# EAGLE board kocka1 (EAGLE 7.2.0), part 1 of 3
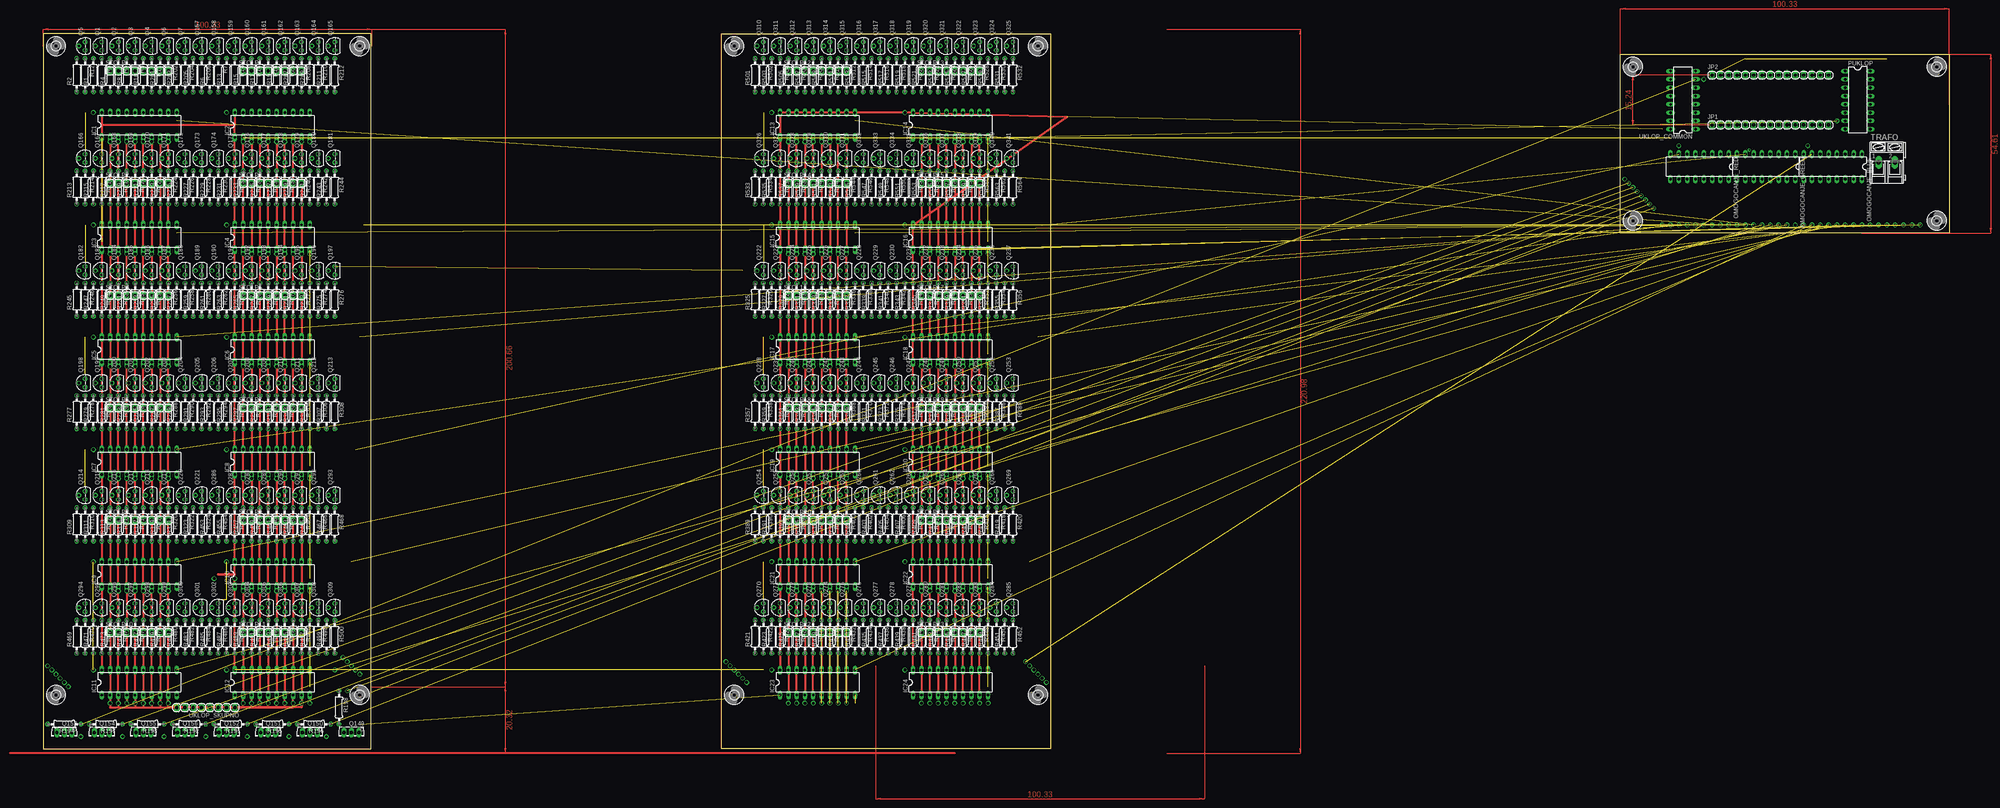
[diagram p5: board, top side]
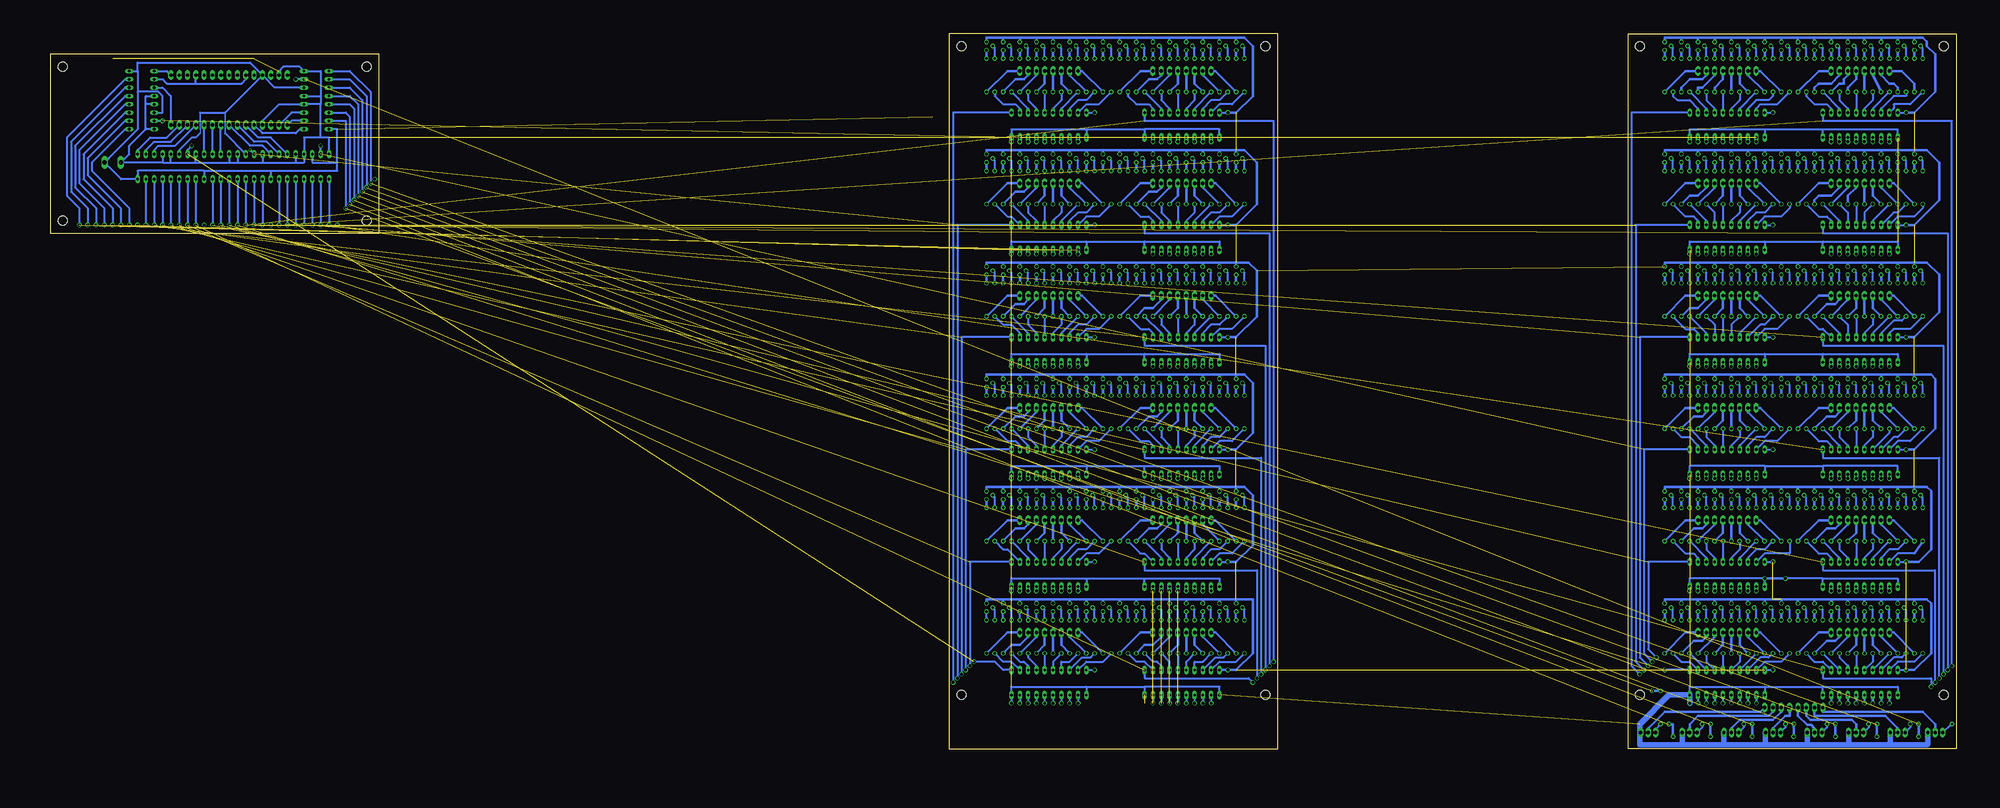
[diagram p6: board, bottom side, seen from below]

Size 581.66 x 218.44 mm. Coordinates in mm from the lower left corner, seen from the top.
Outline: 0,0 100,0 100,218.43 0,218.43 0,0
Outline: 207.01,218.44 307.34,218.44 307.34,0 207.01,0 207.01,218.44
Outline: 481.33,212.09 581.66,212.09 581.66,157.48 481.33,157.48 481.33,212.09
Copper layers (1*16): Top 0.035mm / dielectric 1.5mm / Bottom 0.035mm
Design rules "default *": minimum track width 10mil, minimum drill 24mil, track to track 40mil, track to pad 40mil, pad to pad 8mil, via to via 8mil, smd to smd 8mil, copper to edge 40mil, drill to drill 8mil, minimum pad ring 10mil, minimum via ring 8mil, stop-mask expansion 4mil, vias tented up to drill 0mil, thermal gap 10mil

## Footprints (pad centres in the part's own frame; a part is rotated, then mirrored left to right if it is on the bottom)
2,8 = hole 2.8: 0,0
DIL20 = drill 0.813 long: 1 -11.43,-3.81; 2 -8.89,-3.81; 3 -6.35,-3.81; 4 -3.81,-3.81; 5 -1.27,-3.81; 6 1.27,-3.81; 7 3.81,-3.81; 8 6.35,-3.81; 9 8.89,-3.81; 10 11.43,-3.81; 11 11.43,3.81; 12 8.89,3.81; 13 6.35,3.81; 14 3.81,3.81; 15 1.27,3.81; 16 -1.27,3.81; 17 -3.81,3.81; 18 -6.35,3.81; 19 -8.89,3.81; 20 -11.43,3.81
1X15 = drill 1.016 long: 1 -17.78,0; 2 -15.24,0; 3 -12.7,0; 4 -10.16,0; 5 -7.62,0; 6 -5.08,0; 7 -2.54,0; 8 0,0; 9 2.54,0; 10 5.08,0; 11 7.62,0; 12 10.16,0; 13 12.7,0; 14 15.24,0; 15 17.78,0
DIL16 = drill 0.813 long: 1 -8.89,-3.81; 2 -6.35,-3.81; 3 -3.81,-3.81; 4 -1.27,-3.81; 5 1.27,-3.81; 6 3.81,-3.81; 7 6.35,-3.81; 8 8.89,-3.81; 9 8.89,3.81; 10 6.35,3.81; 11 3.81,3.81; 12 1.27,3.81; 13 -1.27,3.81; 14 -3.81,3.81; 15 -6.35,3.81; 16 -8.89,3.81
TO92 = drill 0.813 octagon: 1 1.27,0; 2 0,1.905; 3 -1.27,0
TO126AV = drill 1.016 long: B 2.286,-1.27; C 0,-1.27; E -2.286,-1.27
0207/10 = drill 0.813 octagon: 1 -5.08,0; 2 5.08,0
1X08 = drill 1.016 long: 1 -8.89,0; 2 -6.35,0; 3 -3.81,0; 4 -1.27,0; 5 1.27,0; 6 3.81,0; 7 6.35,0; 8 8.89,0
AK300/2 = drill 1.321 long: 1 -2.515,0; 2 2.489,0

## Placement (x,y rotation side)
H5  MOUNT-HOLE2.8  [2,8]  485.14,208.28 0 top
H6  MOUNT-HOLE2.8  [2,8]  577.85,161.29 0 top
H7  MOUNT-HOLE2.8  [2,8]  485.14,161.29 0 top
H8  MOUNT-HOLE2.8  [2,8]  577.85,208.28 0 top
H9  MOUNT-HOLE2.8  [2,8]  303.53,16.51 0 top
H10  MOUNT-HOLE2.8  [2,8]  210.82,16.51 0 top
H11  MOUNT-HOLE2.8  [2,8]  303.53,214.63 0 top
H12  MOUNT-HOLE2.8  [2,8]  210.82,214.63 0 top
H13  MOUNT-HOLE2.8  [2,8]  96.52,214.63 0 top
H14  MOUNT-HOLE2.8  [2,8]  3.81,214.63 0 top
H15  MOUNT-HOLE2.8  [2,8]  3.81,16.51 0 top
H16  MOUNT-HOLE2.8  [2,8]  96.52,16.51 0 top
IC1  74HC574N  [DIL20]  29.21,190.5 0 top
IC2  74HC574N  [DIL20]  69.85,190.5 0 top
IC3  74HC574N  [DIL20]  29.21,156.21 0 top
IC4  74HC574N  [DIL20]  69.85,156.21 0 top
IC5  74HC574N  [DIL20]  29.21,121.92 0 top
IC6  74HC574N  [DIL20]  69.85,121.92 0 top
IC7  74HC574N  [DIL20]  29.21,87.63 0 top
IC8  74HC574N  [DIL20]  69.85,87.63 0 top
IC9  74HC574N  [DIL20]  29.21,53.34 0 top
IC10  74HC574N  [DIL20]  69.85,53.34 0 top
IC11  74HC574N  [DIL20]  29.21,20.32 0 top
IC12  74HC574N  [DIL20]  69.85,20.32 0 top
IC13  74HC574N  [DIL20]  236.22,190.5 0 top
IC14  74HC574N  [DIL20]  276.86,190.5 0 top
IC15  74HC574N  [DIL20]  236.22,156.21 0 top
IC16  74HC574N  [DIL20]  276.86,156.21 0 top
IC17  74HC574N  [DIL20]  236.22,121.92 0 top
IC18  74HC574N  [DIL20]  276.86,121.92 0 top
IC19  74HC574N  [DIL20]  236.22,87.63 0 top
IC20  74HC574N  [DIL20]  276.86,87.63 0 top
IC21  74HC574N  [DIL20]  236.22,53.34 0 top
IC22  74HC574N  [DIL20]  276.86,53.34 0 top
IC23  74HC574N  [DIL20]  236.22,20.32 0 top
IC24  74HC574N  [DIL20]  276.86,20.32 0 top
JP1  [1X15]  527.05,190.5 0 top
JP2  [1X15]  527.05,205.74 0 top
OMOGOCANJE_BLUE  74HC138N  [DIL16]  546.1,177.8 180 top
OMOGOCANJE_GREEN  74HC138N  [DIL16]  525.78,177.8 180 top
OMOGOCANJE_RED  74HC138N  [DIL16]  505.46,177.8 180 top
PUKLOP  74HC138N  [DIL16]  553.72,198.12 270 top
Q1  2N3904  [TO92]  17.78,214.63 90 top
Q2  2N3904  [TO92]  22.86,214.63 90 top
Q3  2N3904  [TO92]  27.94,214.63 90 top
Q4  2N3904  [TO92]  33.02,214.63 90 top
Q5  2N3904  [TO92]  12.7,214.63 90 top
Q6  2N3904  [TO92]  38.1,214.63 90 top
Q7  2N3904  [TO92]  43.18,214.63 90 top
Q149  BD139  [TO126AV]  93.98,3.81 180 top
Q150  BD139  [TO126AV]  81.28,3.81 180 top
Q151  BD139  [TO126AV]  68.58,3.81 180 top
Q152  BD139  [TO126AV]  55.88,3.81 180 top
Q153  BD139  [TO126AV]  6.35,3.81 180 top
Q154  BD139  [TO126AV]  17.78,3.81 180 top
Q155  BD139  [TO126AV]  30.48,3.81 180 top
Q156  BD139  [TO126AV]  43.18,3.81 180 top
Q157  2N3904  [TO92]  48.26,214.63 90 top
Q158  2N3904  [TO92]  53.34,214.63 90 top
Q159  2N3904  [TO92]  58.42,214.63 90 top
Q160  2N3904  [TO92]  63.5,214.63 90 top
Q161  2N3904  [TO92]  68.58,214.63 90 top
Q162  2N3904  [TO92]  73.66,214.63 90 top
Q163  2N3904  [TO92]  78.74,214.63 90 top
Q164  2N3904  [TO92]  83.82,214.63 90 top
Q165  2N3904  [TO92]  88.9,214.63 90 top
Q166  2N3904  [TO92]  12.7,180.34 90 top
Q167  2N3904  [TO92]  17.78,180.34 90 top
Q168  2N3904  [TO92]  22.86,180.34 90 top
Q169  2N3904  [TO92]  27.94,180.34 90 top
Q170  2N3904  [TO92]  33.02,180.34 90 top
Q171  2N3904  [TO92]  38.1,180.34 90 top
Q172  2N3904  [TO92]  43.18,180.34 90 top
Q173  2N3904  [TO92]  48.26,180.34 90 top
Q174  2N3904  [TO92]  53.34,180.34 90 top
Q175  2N3904  [TO92]  58.42,180.34 90 top
Q176  2N3904  [TO92]  63.5,180.34 90 top
Q177  2N3904  [TO92]  68.58,180.34 90 top
Q178  2N3904  [TO92]  73.66,180.34 90 top
Q179  2N3904  [TO92]  78.74,180.34 90 top
Q180  2N3904  [TO92]  83.82,180.34 90 top
Q181  2N3904  [TO92]  88.9,180.34 90 top
Q182  2N3904  [TO92]  12.7,146.05 90 top
Q183  2N3904  [TO92]  17.78,146.05 90 top
Q184  2N3904  [TO92]  22.86,146.05 90 top
Q185  2N3904  [TO92]  27.94,146.05 90 top
Q186  2N3904  [TO92]  33.02,146.05 90 top
Q187  2N3904  [TO92]  38.1,146.05 90 top
Q188  2N3904  [TO92]  43.18,146.05 90 top
Q189  2N3904  [TO92]  48.26,146.05 90 top
Q190  2N3904  [TO92]  53.34,146.05 90 top
Q191  2N3904  [TO92]  58.42,146.05 90 top
Q192  2N3904  [TO92]  63.5,146.05 90 top
Q193  2N3904  [TO92]  68.58,146.05 90 top
Q194  2N3904  [TO92]  73.66,146.05 90 top
Q195  2N3904  [TO92]  78.74,146.05 90 top
Q196  2N3904  [TO92]  83.82,146.05 90 top
Q197  2N3904  [TO92]  88.9,146.05 90 top
Q198  2N3904  [TO92]  12.7,111.76 90 top
Q199  2N3904  [TO92]  17.78,111.76 90 top
Q200  2N3904  [TO92]  22.86,111.76 90 top
Q201  2N3904  [TO92]  27.94,111.76 90 top
Q202  2N3904  [TO92]  33.02,111.76 90 top
Q203  2N3904  [TO92]  38.1,111.76 90 top
Q204  2N3904  [TO92]  43.18,111.76 90 top
Q205  2N3904  [TO92]  48.26,111.76 90 top
Q206  2N3904  [TO92]  53.34,111.76 90 top
Q207  2N3904  [TO92]  58.42,111.76 90 top
Q208  2N3904  [TO92]  63.5,111.76 90 top
Q209  2N3904  [TO92]  68.58,111.76 90 top
Q210  2N3904  [TO92]  73.66,111.76 90 top
Q211  2N3904  [TO92]  78.74,111.76 90 top
Q212  2N3904  [TO92]  83.82,111.76 90 top
Q213  2N3904  [TO92]  88.9,111.76 90 top
Q214  2N3904  [TO92]  12.7,77.47 90 top
Q215  2N3904  [TO92]  17.78,77.47 90 top
Q216  2N3904  [TO92]  22.86,77.47 90 top
Q217  2N3904  [TO92]  27.94,77.47 90 top
Q218  2N3904  [TO92]  33.02,77.47 90 top
Q219  2N3904  [TO92]  38.1,77.47 90 top
Q220  2N3904  [TO92]  43.18,77.47 90 top
Q221  2N3904  [TO92]  48.26,77.47 90 top
Q222  2N3904  [TO92]  219.71,146.05 90 top
Q223  2N3904  [TO92]  224.79,146.05 90 top
Q224  2N3904  [TO92]  229.87,146.05 90 top
Q225  2N3904  [TO92]  234.95,146.05 90 top
Q226  2N3904  [TO92]  240.03,146.05 90 top
Q227  2N3904  [TO92]  245.11,146.05 90 top
Q228  2N3904  [TO92]  250.19,146.05 90 top
Q229  2N3904  [TO92]  255.27,146.05 90 top
Q230  2N3904  [TO92]  260.35,146.05 90 top
Q231  2N3904  [TO92]  265.43,146.05 90 top
Q232  2N3904  [TO92]  270.51,146.05 90 top
Q233  2N3904  [TO92]  275.59,146.05 90 top
Q234  2N3904  [TO92]  280.67,146.05 90 top
Q235  2N3904  [TO92]  285.75,146.05 90 top
Q236  2N3904  [TO92]  290.83,146.05 90 top
Q237  2N3904  [TO92]  295.91,146.05 90 top
Q238  2N3904  [TO92]  219.71,111.76 90 top
Q239  2N3904  [TO92]  224.79,111.76 90 top
Q240  2N3904  [TO92]  229.87,111.76 90 top
Q241  2N3904  [TO92]  234.95,111.76 90 top
Q242  2N3904  [TO92]  240.03,111.76 90 top
Q243  2N3904  [TO92]  245.11,111.76 90 top
Q244  2N3904  [TO92]  250.19,111.76 90 top
Q245  2N3904  [TO92]  255.27,111.76 90 top
Q246  2N3904  [TO92]  260.35,111.76 90 top
Q247  2N3904  [TO92]  265.43,111.76 90 top
Q248  2N3904  [TO92]  270.51,111.76 90 top
Q249  2N3904  [TO92]  275.59,111.76 90 top
Q250  2N3904  [TO92]  280.67,111.76 90 top
Q251  2N3904  [TO92]  285.75,111.76 90 top
Q252  2N3904  [TO92]  290.83,111.76 90 top
Q253  2N3904  [TO92]  295.91,111.76 90 top
Q254  2N3904  [TO92]  219.71,77.47 90 top
Q255  2N3904  [TO92]  224.79,77.47 90 top
Q256  2N3904  [TO92]  229.87,77.47 90 top
Q257  2N3904  [TO92]  234.95,77.47 90 top
Q258  2N3904  [TO92]  240.03,77.47 90 top
Q259  2N3904  [TO92]  245.11,77.47 90 top
Q260  2N3904  [TO92]  250.19,77.47 90 top
Q261  2N3904  [TO92]  255.27,77.47 90 top
Q262  2N3904  [TO92]  260.35,77.47 90 top
Q263  2N3904  [TO92]  265.43,77.47 90 top
Q264  2N3904  [TO92]  270.51,77.47 90 top
Q265  2N3904  [TO92]  275.59,77.47 90 top
Q266  2N3904  [TO92]  280.67,77.47 90 top
Q267  2N3904  [TO92]  285.75,77.47 90 top
Q268  2N3904  [TO92]  290.83,77.47 90 top
Q269  2N3904  [TO92]  295.91,77.47 90 top
Q270  2N3904  [TO92]  219.71,43.18 90 top
Q271  2N3904  [TO92]  224.79,43.18 90 top
Q272  2N3904  [TO92]  229.87,43.18 90 top
Q273  2N3904  [TO92]  234.95,43.18 90 top
Q274  2N3904  [TO92]  240.03,43.18 90 top
Q275  2N3904  [TO92]  245.11,43.18 90 top
Q276  2N3904  [TO92]  250.19,43.18 90 top
Q277  2N3904  [TO92]  255.27,43.18 90 top
Q278  2N3904  [TO92]  260.35,43.18 90 top
Q279  2N3904  [TO92]  265.43,43.18 90 top
Q280  2N3904  [TO92]  270.51,43.18 90 top
Q281  2N3904  [TO92]  275.59,43.18 90 top
Q282  2N3904  [TO92]  280.67,43.18 90 top
Q283  2N3904  [TO92]  285.75,43.18 90 top
Q284  2N3904  [TO92]  290.83,43.18 90 top
Q285  2N3904  [TO92]  295.91,43.18 90 top
Q286  2N3904  [TO92]  53.34,77.47 90 top
Q287  2N3904  [TO92]  58.42,77.47 90 top
Q288  2N3904  [TO92]  63.5,77.47 90 top
Q289  2N3904  [TO92]  68.58,77.47 90 top
Q290  2N3904  [TO92]  73.66,77.47 90 top
Q291  2N3904  [TO92]  78.74,77.47 90 top
Q292  2N3904  [TO92]  83.82,77.47 90 top
Q293  2N3904  [TO92]  88.9,77.47 90 top
Q294  2N3904  [TO92]  12.7,43.18 90 top
Q295  2N3904  [TO92]  17.78,43.18 90 top
Q296  2N3904  [TO92]  22.86,43.18 90 top
Q297  2N3904  [TO92]  27.94,43.18 90 top
Q298  2N3904  [TO92]  33.02,43.18 90 top
Q299  2N3904  [TO92]  38.1,43.18 90 top
Q300  2N3904  [TO92]  43.18,43.18 90 top
Q301  2N3904  [TO92]  48.26,43.18 90 top
Q302  2N3904  [TO92]  53.34,43.18 90 top
Q303  2N3904  [TO92]  58.42,43.18 90 top
Q304  2N3904  [TO92]  63.5,43.18 90 top
Q305  2N3904  [TO92]  68.58,43.18 90 top
Q306  2N3904  [TO92]  73.66,43.18 90 top
Q307  2N3904  [TO92]  78.74,43.18 90 top
Q308  2N3904  [TO92]  83.82,43.18 90 top
Q309  2N3904  [TO92]  88.9,43.18 90 top
Q310  2N3904  [TO92]  219.71,214.63 90 top
Q311  2N3904  [TO92]  224.79,214.63 90 top
Q312  2N3904  [TO92]  229.87,214.63 90 top
Q313  2N3904  [TO92]  234.95,214.63 90 top
Q314  2N3904  [TO92]  240.03,214.63 90 top
Q315  2N3904  [TO92]  245.11,214.63 90 top
Q316  2N3904  [TO92]  250.19,214.63 90 top
Q317  2N3904  [TO92]  255.27,214.63 90 top
Q318  2N3904  [TO92]  260.35,214.63 90 top
Q319  2N3904  [TO92]  265.43,214.63 90 top
Q320  2N3904  [TO92]  270.51,214.63 90 top
Q321  2N3904  [TO92]  275.59,214.63 90 top
Q322  2N3904  [TO92]  280.67,214.63 90 top
Q323  2N3904  [TO92]  285.75,214.63 90 top
Q324  2N3904  [TO92]  290.83,214.63 90 top
Q325  2N3904  [TO92]  295.91,214.63 90 top
Q326  2N3904  [TO92]  219.71,180.34 90 top
Q327  2N3904  [TO92]  224.79,180.34 90 top
Q328  2N3904  [TO92]  229.87,180.34 90 top
Q329  2N3904  [TO92]  234.95,180.34 90 top
Q330  2N3904  [TO92]  240.03,180.34 90 top
Q331  2N3904  [TO92]  245.11,180.34 90 top
Q332  2N3904  [TO92]  250.19,180.34 90 top
Q333  2N3904  [TO92]  255.27,180.34 90 top
Q334  2N3904  [TO92]  260.35,180.34 90 top
Q335  2N3904  [TO92]  265.43,180.34 90 top
Q336  2N3904  [TO92]  270.51,180.34 90 top
Q337  2N3904  [TO92]  275.59,180.34 90 top
Q338  2N3904  [TO92]  280.67,180.34 90 top
Q339  2N3904  [TO92]  285.75,180.34 90 top
Q340  2N3904  [TO92]  290.83,180.34 90 top
Q341  2N3904  [TO92]  295.91,180.34 90 top
R1  1k  [0207/10]  15.24,205.74 90 top
R2  1k  [0207/10]  10.16,205.74 90 top
R3  240  [0207/10]  17.78,205.74 270 top
R4  1k  [0207/10]  20.32,205.74 90 top
R5  240  [0207/10]  22.86,205.74 270 top
R6  1k  [0207/10]  50.8,205.74 90 top
R7  240  [0207/10]  53.34,205.74 270 top
R8  1k  [0207/10]  25.4,205.74 90 top
R9  240  [0207/10]  27.94,205.74 270 top
R10  1k  [0207/10]  30.48,205.74 90 top
R11  240  [0207/10]  33.02,205.74 270 top
R12  240  [0207/10]  12.7,205.74 270 top
R13  1k  [0207/10]  55.88,205.74 90 top
R14  240  [0207/10]  58.42,205.74 270 top
R15  1k  [0207/10]  60.96,205.74 90 top
R16  240  [0207/10]  63.5,205.74 270 top
R17  1k  [0207/10]  66.04,205.74 90 top
R18  240  [0207/10]  68.58,205.74 270 top
R19  1k  [0207/10]  71.12,205.74 90 top
R20  240  [0207/10]  73.66,205.74 270 top
R191  240  [0207/10]  57.15,7.62 180 top
R192  240  [0207/10]  44.45,7.62 180 top
R193  240  [0207/10]  31.75,7.62 180 top
R194  240  [0207/10]  6.35,7.62 180 top
R195  240  [0207/10]  69.85,7.62 180 top
R196  240  [0207/10]  82.55,7.62 180 top
R197  240  [0207/10]  19.05,7.62 180 top
R198  240  [0207/10]  90.17,12.7 270 top
R201  1k  [0207/10]  35.56,205.74 90 top
R202  240  [0207/10]  38.1,205.74 270 top
R203  1k  [0207/10]  40.64,205.74 90 top
R204  240  [0207/10]  43.18,205.74 270 top
R205  1k  [0207/10]  45.72,205.74 90 top
R206  240  [0207/10]  48.26,205.74 270 top
R207  1k  [0207/10]  76.2,205.74 90 top
R208  240  [0207/10]  78.74,205.74 270 top
R209  1k  [0207/10]  81.28,205.74 90 top
R210  240  [0207/10]  83.82,205.74 270 top
R211  1k  [0207/10]  86.36,205.74 90 top
R212  240  [0207/10]  88.9,205.74 270 top
R213  1k  [0207/10]  10.16,171.45 90 top
R214  240  [0207/10]  12.7,171.45 270 top
R215  1k  [0207/10]  15.24,171.45 90 top
R216  240  [0207/10]  17.78,171.45 270 top
R217  1k  [0207/10]  20.32,171.45 90 top
R218  240  [0207/10]  22.86,171.45 270 top
R219  1k  [0207/10]  25.4,171.45 90 top
R220  240  [0207/10]  27.94,171.45 270 top
R221  1k  [0207/10]  30.48,171.45 90 top
R222  240  [0207/10]  33.02,171.45 270 top
R223  1k  [0207/10]  35.56,171.45 90 top
R224  240  [0207/10]  38.1,171.45 270 top
R225  1k  [0207/10]  40.64,171.45 90 top
R226  240  [0207/10]  43.18,171.45 270 top
R227  1k  [0207/10]  45.72,171.45 90 top
R228  240  [0207/10]  48.26,171.45 270 top
R229  1k  [0207/10]  50.8,171.45 90 top
R230  240  [0207/10]  53.34,171.45 270 top
R231  1k  [0207/10]  55.88,171.45 90 top
R232  240  [0207/10]  58.42,171.45 270 top
R233  1k  [0207/10]  60.96,171.45 90 top
R234  240  [0207/10]  63.5,171.45 270 top
R235  1k  [0207/10]  66.04,171.45 90 top
R236  240  [0207/10]  68.58,171.45 270 top
R237  1k  [0207/10]  71.12,171.45 90 top
R238  240  [0207/10]  73.66,171.45 270 top
R239  1k  [0207/10]  76.2,171.45 90 top
R240  240  [0207/10]  78.74,171.45 270 top
R241  1k  [0207/10]  81.28,171.45 90 top
R242  240  [0207/10]  83.82,171.45 270 top
R243  1k  [0207/10]  86.36,171.45 90 top
R244  240  [0207/10]  88.9,171.45 270 top
R245  1k  [0207/10]  10.16,137.16 90 top
R246  240  [0207/10]  12.7,137.16 270 top
R247  1k  [0207/10]  15.24,137.16 90 top
R248  240  [0207/10]  17.78,137.16 270 top
R249  1k  [0207/10]  20.32,137.16 90 top
R250  240  [0207/10]  22.86,137.16 270 top
R251  1k  [0207/10]  25.4,137.16 90 top
R252  240  [0207/10]  27.94,137.16 270 top
R253  1k  [0207/10]  30.48,137.16 90 top
R254  240  [0207/10]  33.02,137.16 270 top
R255  1k  [0207/10]  35.56,137.16 90 top
R256  240  [0207/10]  38.1,137.16 270 top
R257  1k  [0207/10]  40.64,137.16 90 top
R258  240  [0207/10]  43.18,137.16 270 top
R259  1k  [0207/10]  45.72,137.16 90 top
R260  240  [0207/10]  48.26,137.16 270 top
R261  1k  [0207/10]  50.8,137.16 90 top
R262  240  [0207/10]  53.34,137.16 270 top
R263  1k  [0207/10]  55.88,137.16 90 top
R264  240  [0207/10]  58.42,137.16 270 top
R265  1k  [0207/10]  60.96,137.16 90 top
R266  240  [0207/10]  63.5,137.16 270 top
R267  1k  [0207/10]  66.04,137.16 90 top
R268  240  [0207/10]  68.58,137.16 270 top
R269  1k  [0207/10]  71.12,137.16 90 top
R270  240  [0207/10]  73.66,137.16 270 top
R271  1k  [0207/10]  76.2,137.16 90 top
R272  240  [0207/10]  78.74,137.16 270 top
R273  1k  [0207/10]  81.28,137.16 90 top
R274  240  [0207/10]  83.82,137.16 270 top
R275  1k  [0207/10]  86.36,137.16 90 top
R276  240  [0207/10]  88.9,137.16 270 top
R277  1k  [0207/10]  10.16,102.87 90 top
R278  240  [0207/10]  12.7,102.87 270 top
R279  1k  [0207/10]  15.24,102.87 90 top
R280  240  [0207/10]  17.78,102.87 270 top
R281  1k  [0207/10]  20.32,102.87 90 top
R282  240  [0207/10]  22.86,102.87 270 top
R283  1k  [0207/10]  25.4,102.87 90 top
R284  240  [0207/10]  27.94,102.87 270 top
R285  1k  [0207/10]  30.48,102.87 90 top
R286  240  [0207/10]  33.02,102.87 270 top
R287  1k  [0207/10]  35.56,102.87 90 top
R288  240  [0207/10]  38.1,102.87 270 top
R289  1k  [0207/10]  40.64,102.87 90 top
R290  240  [0207/10]  43.18,102.87 270 top
R291  1k  [0207/10]  45.72,102.87 90 top
R292  240  [0207/10]  48.26,102.87 270 top
R293  1k  [0207/10]  50.8,102.87 90 top
R294  240  [0207/10]  53.34,102.87 270 top
R295  1k  [0207/10]  55.88,102.87 90 top
R296  240  [0207/10]  58.42,102.87 270 top
R297  1k  [0207/10]  60.96,102.87 90 top
R298  240  [0207/10]  63.5,102.87 270 top
R299  1k  [0207/10]  66.04,102.87 90 top
R300  240  [0207/10]  68.58,102.87 270 top
R301  1k  [0207/10]  71.12,102.87 90 top
R302  240  [0207/10]  73.66,102.87 270 top
R303  1k  [0207/10]  76.2,102.87 90 top
R304  240  [0207/10]  78.74,102.87 270 top
R305  1k  [0207/10]  81.28,102.87 90 top
R306  240  [0207/10]  83.82,102.87 270 top
R307  1k  [0207/10]  86.36,102.87 90 top
R308  240  [0207/10]  88.9,102.87 270 top
R309  1k  [0207/10]  10.16,68.58 90 top
R310  240  [0207/10]  12.7,68.58 270 top
R311  1k  [0207/10]  15.24,68.58 90 top
R312  240  [0207/10]  17.78,68.58 270 top
R313  1k  [0207/10]  20.32,68.58 90 top
R314  240  [0207/10]  22.86,68.58 270 top
R315  1k  [0207/10]  25.4,68.58 90 top
R316  240  [0207/10]  27.94,68.58 270 top
R317  1k  [0207/10]  30.48,68.58 90 top
R318  240  [0207/10]  33.02,68.58 270 top
R319  1k  [0207/10]  35.56,68.58 90 top
R320  240  [0207/10]  38.1,68.58 270 top
R321  1k  [0207/10]  40.64,68.58 90 top
R322  240  [0207/10]  43.18,68.58 270 top
R323  1k  [0207/10]  45.72,68.58 90 top
R324  240  [0207/10]  48.26,68.58 270 top
R325  1k  [0207/10]  217.17,137.16 90 top
R326  240  [0207/10]  219.71,137.16 270 top
R327  1k  [0207/10]  222.25,137.16 90 top
R328  240  [0207/10]  224.79,137.16 270 top
R329  1k  [0207/10]  227.33,137.16 90 top
R330  240  [0207/10]  229.87,137.16 270 top
R331  1k  [0207/10]  232.41,137.16 90 top
R332  240  [0207/10]  234.95,137.16 270 top
R333  1k  [0207/10]  237.49,137.16 90 top
R334  240  [0207/10]  240.03,137.16 270 top
R335  1k  [0207/10]  242.57,137.16 90 top
R336  240  [0207/10]  245.11,137.16 270 top
R337  1k  [0207/10]  247.65,137.16 90 top
R338  240  [0207/10]  250.19,137.16 270 top
R339  1k  [0207/10]  252.73,137.16 90 top
R340  240  [0207/10]  255.27,137.16 270 top
R341  1k  [0207/10]  257.81,137.16 90 top
R342  240  [0207/10]  260.35,137.16 270 top
R343  1k  [0207/10]  262.89,137.16 90 top
R344  240  [0207/10]  265.43,137.16 270 top
R345  1k  [0207/10]  267.97,137.16 90 top
R346  240  [0207/10]  270.51,137.16 270 top
R347  1k  [0207/10]  273.05,137.16 90 top
R348  240  [0207/10]  275.59,137.16 270 top
R349  1k  [0207/10]  278.13,137.16 90 top
R350  240  [0207/10]  280.67,137.16 270 top
R351  1k  [0207/10]  283.21,137.16 90 top
R352  240  [0207/10]  285.75,137.16 270 top
R353  1k  [0207/10]  288.29,137.16 90 top
R354  240  [0207/10]  290.83,137.16 270 top
R355  1k  [0207/10]  293.37,137.16 90 top
R356  240  [0207/10]  295.91,137.16 270 top
R357  1k  [0207/10]  217.17,102.87 90 top
R358  240  [0207/10]  219.71,102.87 270 top
R359  1k  [0207/10]  222.25,102.87 90 top
R360  240  [0207/10]  224.79,102.87 270 top
R361  1k  [0207/10]  227.33,102.87 90 top
R362  240  [0207/10]  229.87,102.87 270 top
R363  1k  [0207/10]  232.41,102.87 90 top
R364  240  [0207/10]  234.95,102.87 270 top
R365  1k  [0207/10]  237.49,102.87 90 top
R366  240  [0207/10]  240.03,102.87 270 top
R367  1k  [0207/10]  242.57,102.87 90 top
R368  240  [0207/10]  245.11,102.87 270 top
R369  1k  [0207/10]  247.65,102.87 90 top
R370  240  [0207/10]  250.19,102.87 270 top
R371  1k  [0207/10]  252.73,102.87 90 top
R372  240  [0207/10]  255.27,102.87 270 top
R373  1k  [0207/10]  257.81,102.87 90 top
R374  240  [0207/10]  260.35,102.87 270 top
R375  1k  [0207/10]  262.89,102.87 90 top
R376  240  [0207/10]  265.43,102.87 270 top
R377  1k  [0207/10]  267.97,102.87 90 top
R378  240  [0207/10]  270.51,102.87 270 top
R379  1k  [0207/10]  273.05,102.87 90 top
R380  240  [0207/10]  275.59,102.87 270 top
R381  1k  [0207/10]  278.13,102.87 90 top
R382  240  [0207/10]  280.67,102.87 270 top
R383  1k  [0207/10]  283.21,102.87 90 top
R384  240  [0207/10]  285.75,102.87 270 top
R385  1k  [0207/10]  288.29,102.87 90 top
R386  240  [0207/10]  290.83,102.87 270 top
R387  1k  [0207/10]  293.37,102.87 90 top
R388  240  [0207/10]  295.91,102.87 270 top
R389  1k  [0207/10]  217.17,68.58 90 top
R390  240  [0207/10]  219.71,68.58 270 top
R391  1k  [0207/10]  222.25,68.58 90 top
R392  240  [0207/10]  224.79,68.58 270 top
R393  1k  [0207/10]  227.33,68.58 90 top
R394  240  [0207/10]  229.87,68.58 270 top
R395  1k  [0207/10]  232.41,68.58 90 top
R396  240  [0207/10]  234.95,68.58 270 top
R397  1k  [0207/10]  237.49,68.58 90 top
R398  240  [0207/10]  240.03,68.58 270 top
R399  1k  [0207/10]  242.57,68.58 90 top
R400  240  [0207/10]  245.11,68.58 270 top
R401  1k  [0207/10]  247.65,68.58 90 top
R402  240  [0207/10]  250.19,68.58 270 top
R403  1k  [0207/10]  252.73,68.58 90 top
R404  240  [0207/10]  255.27,68.58 270 top
R405  1k  [0207/10]  257.81,68.58 90 top
R406  240  [0207/10]  260.35,68.58 270 top
R407  1k  [0207/10]  262.89,68.58 90 top
R408  240  [0207/10]  265.43,68.58 270 top
R409  1k  [0207/10]  267.97,68.58 90 top
R410  240  [0207/10]  270.51,68.58 270 top
R411  1k  [0207/10]  273.05,68.58 90 top
R412  240  [0207/10]  275.59,68.58 270 top
R413  1k  [0207/10]  278.13,68.58 90 top
R414  240  [0207/10]  280.67,68.58 270 top
R415  1k  [0207/10]  283.21,68.58 90 top
R416  240  [0207/10]  285.75,68.58 270 top
R417  1k  [0207/10]  288.29,68.58 90 top
R418  240  [0207/10]  290.83,68.58 270 top
R419  1k  [0207/10]  293.37,68.58 90 top
R420  240  [0207/10]  295.91,68.58 270 top
R421  1k  [0207/10]  217.17,34.29 90 top
R422  240  [0207/10]  219.71,34.29 270 top
R423  1k  [0207/10]  222.25,34.29 90 top
R424  240  [0207/10]  224.79,34.29 270 top
R425  1k  [0207/10]  227.33,34.29 90 top
R426  240  [0207/10]  229.87,34.29 270 top
R427  1k  [0207/10]  232.41,34.29 90 top
R428  240  [0207/10]  234.95,34.29 270 top
R429  1k  [0207/10]  237.49,34.29 90 top
R430  240  [0207/10]  240.03,34.29 270 top
R431  1k  [0207/10]  242.57,34.29 90 top
R432  240  [0207/10]  245.11,34.29 270 top
R433  1k  [0207/10]  247.65,34.29 90 top
R434  240  [0207/10]  250.19,34.29 270 top
R435  1k  [0207/10]  252.73,34.29 90 top
R436  240  [0207/10]  255.27,34.29 270 top
R437  1k  [0207/10]  257.81,34.29 90 top
R438  240  [0207/10]  260.35,34.29 270 top
R439  1k  [0207/10]  262.89,34.29 90 top
R440  240  [0207/10]  265.43,34.29 270 top
R441  1k  [0207/10]  267.97,34.29 90 top
R442  240  [0207/10]  270.51,34.29 270 top
R443  1k  [0207/10]  273.05,34.29 90 top
R444  240  [0207/10]  275.59,34.29 270 top
R445  1k  [0207/10]  278.13,34.29 90 top
R446  240  [0207/10]  280.67,34.29 270 top
R447  1k  [0207/10]  283.21,34.29 90 top
R448  240  [0207/10]  285.75,34.29 270 top
R449  1k  [0207/10]  288.29,34.29 90 top
R450  240  [0207/10]  290.83,34.29 270 top
R451  1k  [0207/10]  293.37,34.29 90 top
R452  240  [0207/10]  295.91,34.29 270 top
R453  1k  [0207/10]  50.8,68.58 90 top
R454  240  [0207/10]  53.34,68.58 270 top
R455  1k  [0207/10]  55.88,68.58 90 top
R456  240  [0207/10]  58.42,68.58 270 top
R457  1k  [0207/10]  60.96,68.58 90 top
R458  240  [0207/10]  63.5,68.58 270 top
R459  1k  [0207/10]  66.04,68.58 90 top
R460  240  [0207/10]  68.58,68.58 270 top
R461  1k  [0207/10]  71.12,68.58 90 top
R462  240  [0207/10]  73.66,68.58 270 top
R463  1k  [0207/10]  76.2,68.58 90 top
R464  240  [0207/10]  78.74,68.58 270 top
R465  1k  [0207/10]  81.28,68.58 90 top
R466  240  [0207/10]  83.82,68.58 270 top
R467  1k  [0207/10]  86.36,68.58 90 top
R468  240  [0207/10]  88.9,68.58 270 top
R469  1k  [0207/10]  10.16,34.29 90 top
R470  240  [0207/10]  12.7,34.29 270 top
R471  1k  [0207/10]  15.24,34.29 90 top
R472  240  [0207/10]  17.78,34.29 270 top
R473  1k  [0207/10]  20.32,34.29 90 top
R474  240  [0207/10]  22.86,34.29 270 top
R475  1k  [0207/10]  25.4,34.29 90 top
R476  240  [0207/10]  27.94,34.29 270 top
R477  1k  [0207/10]  30.48,34.29 90 top
R478  240  [0207/10]  33.02,34.29 270 top
R479  1k  [0207/10]  35.56,34.29 90 top
R480  240  [0207/10]  38.1,34.29 270 top
R481  1k  [0207/10]  40.64,34.29 90 top
R482  240  [0207/10]  43.18,34.29 270 top
R483  1k  [0207/10]  45.72,34.29 90 top
R484  240  [0207/10]  48.26,34.29 270 top
R485  1k  [0207/10]  50.8,34.29 90 top
R486  240  [0207/10]  53.34,34.29 270 top
R487  1k  [0207/10]  55.88,34.29 90 top
R488  240  [0207/10]  58.42,34.29 270 top
R489  1k  [0207/10]  60.96,34.29 90 top
R490  240  [0207/10]  63.5,34.29 270 top
R491  1k  [0207/10]  66.04,34.29 90 top
R492  240  [0207/10]  68.58,34.29 270 top
R493  1k  [0207/10]  71.12,34.29 90 top
R494  240  [0207/10]  73.66,34.29 270 top
R495  1k  [0207/10]  76.2,34.29 90 top
R496  240  [0207/10]  78.74,34.29 270 top
R497  1k  [0207/10]  81.28,34.29 90 top
R498  240  [0207/10]  83.82,34.29 270 top
R499  1k  [0207/10]  86.36,34.29 90 top
R500  240  [0207/10]  88.9,34.29 270 top
R501  1k  [0207/10]  217.17,205.74 90 top
R502  240  [0207/10]  219.71,205.74 270 top
R503  1k  [0207/10]  222.25,205.74 90 top
R504  240  [0207/10]  224.79,205.74 270 top
R505  1k  [0207/10]  227.33,205.74 90 top
R506  240  [0207/10]  229.87,205.74 270 top
R507  1k  [0207/10]  232.41,205.74 90 top
R508  240  [0207/10]  234.95,205.74 270 top
R509  1k  [0207/10]  237.49,205.74 90 top
R510  240  [0207/10]  240.03,205.74 270 top
R511  1k  [0207/10]  242.57,205.74 90 top
R512  240  [0207/10]  245.11,205.74 270 top
R513  1k  [0207/10]  247.65,205.74 90 top
R514  240  [0207/10]  250.19,205.74 270 top
R515  1k  [0207/10]  252.73,205.74 90 top
R516  240  [0207/10]  255.27,205.74 270 top
R517  1k  [0207/10]  257.81,205.74 90 top
R518  240  [0207/10]  260.35,205.74 270 top
R519  1k  [0207/10]  262.89,205.74 90 top
R520  240  [0207/10]  265.43,205.74 270 top
R521  1k  [0207/10]  267.97,205.74 90 top
R522  240  [0207/10]  270.51,205.74 270 top
R523  1k  [0207/10]  273.05,205.74 90 top
R524  240  [0207/10]  275.59,205.74 270 top
R525  1k  [0207/10]  278.13,205.74 90 top
R526  240  [0207/10]  280.67,205.74 270 top
R527  1k  [0207/10]  283.21,205.74 90 top
R528  240  [0207/10]  285.75,205.74 270 top
R529  1k  [0207/10]  288.29,205.74 90 top
R530  240  [0207/10]  290.83,205.74 270 top
R531  1k  [0207/10]  293.37,205.74 90 top
R532  240  [0207/10]  295.91,205.74 270 top
R533  1k  [0207/10]  217.17,171.45 90 top
R534  240  [0207/10]  219.71,171.45 270 top
R535  1k  [0207/10]  222.25,171.45 90 top
R536  240  [0207/10]  224.79,171.45 270 top
R537  1k  [0207/10]  227.33,171.45 90 top
R538  240  [0207/10]  229.87,171.45 270 top
R539  1k  [0207/10]  232.41,171.45 90 top
R540  240  [0207/10]  234.95,171.45 270 top
R541  1k  [0207/10]  237.49,171.45 90 top
R542  240  [0207/10]  240.03,171.45 270 top
R543  1k  [0207/10]  242.57,171.45 90 top
R544  240  [0207/10]  245.11,171.45 270 top
R545  1k  [0207/10]  247.65,171.45 90 top
R546  240  [0207/10]  250.19,171.45 270 top
R547  1k  [0207/10]  252.73,171.45 90 top
R548  240  [0207/10]  255.27,171.45 270 top
R549  1k  [0207/10]  257.81,171.45 90 top
R550  240  [0207/10]  260.35,171.45 270 top
R551  1k  [0207/10]  262.89,171.45 90 top
R552  240  [0207/10]  265.43,171.45 270 top
R553  1k  [0207/10]  267.97,171.45 90 top
R554  240  [0207/10]  270.51,171.45 270 top
R555  1k  [0207/10]  273.05,171.45 90 top
R556  240  [0207/10]  275.59,171.45 270 top
R557  1k  [0207/10]  278.13,171.45 90 top
R558  240  [0207/10]  280.67,171.45 270 top
R559  1k  [0207/10]  283.21,171.45 90 top
R560  240  [0207/10]  285.75,171.45 270 top
R561  1k  [0207/10]  288.29,171.45 90 top
R562  240  [0207/10]  290.83,171.45 270 top
R563  1k  [0207/10]  293.37,171.45 90 top
R564  240  [0207/10]  295.91,171.45 270 top
STOL16  [1X08]  236.22,138.43 0 top
STOLP  [1X08]  29.21,207.01 0 top
STOLP1  [1X08]  69.85,207.01 0 top
STOLP2  [1X08]  29.21,172.72 0 top
STOLP3  [1X08]  69.85,172.72 0 top
STOLP4  [1X08]  29.21,138.43 0 top
STOLP5  [1X08]  69.85,138.43 0 top
STOLP6  [1X08]  29.21,104.14 0 top
STOLP7  [1X08]  69.85,104.14 0 top
STOLP8  [1X08]  29.21,69.85 0 top
STOLP9  [1X08]  69.85,69.85 0 top
STOLP10  [1X08]  29.21,35.56 0 top
STOLP11  [1X08]  69.85,35.56 0 top
STOLP12  [1X08]  236.22,207.01 0 top
STOLP13  [1X08]  276.86,207.01 0 top
STOLP14  [1X08]  236.22,172.72 0 top
STOLP15  [1X08]  276.86,172.72 0 top
STOLP17  [1X08]  276.86,138.43 0 top
STOLP18  [1X08]  236.22,104.14 0 top
STOLP19  [1X08]  276.86,104.14 0 top
STOLP20  [1X08]  236.22,69.85 0 top
STOLP21  [1X08]  276.86,69.85 0 top
STOLP22  [1X08]  236.22,35.56 0 top
STOLP23  [1X08]  276.86,35.56 0 top
TRAFO  [AK300/2]  562.61,179.07 0 top
UKLOP_COMMON  74HC138N  [DIL16]  500.38,198.12 90 top
UKLOP_SKUPNO  [1X08]  49.53,12.7 180 top

## Tracks (layer width: path | path; a pad name or v marks a point on that pad's centre or on a via)
0V  (via drill 0.9 pad 1.02)  (17 unrouted)
  Bottom 0.61: IC1.1 17.78,189.23 40.64,189.23 | IC1.10 40.64,189.23 | IC2.10 81.28,189.23 58.42,189.23 | 58.42,189.23 IC2.1 | IC5.10 40.64,120.65 | 40.64,120.65 17.78,120.65 IC5.1 | IC3.10 40.64,154.94 | 40.64,154.94 17.78,154.94 IC3.1 | IC4.10 81.28,154.94 58.42,154.94 | 58.42,154.94 IC4.1 | 40.64,86.36 IC7.10 | IC7.1 17.78,86.36 40.64,86.36 | IC8.10 81.28,86.36 58.42,86.36 | 58.42,86.36 IC8.1 | 40.64,52.07 17.78,52.07 IC9.1 | IC10.10 81.28,52.07 58.42,52.07 IC10.1 | IC11.10 40.64,19.05 | 40.64,19.05 17.78,19.05 IC11.1 | IC12.10 81.28,19.05 58.42,19.05 | 58.42,19.05 IC12.1 | 58.42,189.23 40.64,189.23 | 58.42,19.05 40.64,19.05 | 58.42,86.36 40.64,86.36 | IC6.10 81.28,120.65 58.42,120.65 | 58.42,120.65 IC6.1 | 58.42,120.65 40.64,120.65 | 58.42,154.94 40.64,154.94 | IC13.1 224.79,189.23 247.65,189.23 | 247.65,189.23 IC13.10 | 265.43,189.23 288.29,189.23 IC14.10 | 265.43,189.23 IC14.1 | 265.43,189.23 247.65,189.23 | IC15.10 247.65,154.94 | 247.65,154.94 224.79,154.94 IC15.1 | IC16.10 288.29,154.94 265.43,154.94 | 265.43,154.94 IC16.1 | IC17.10 247.65,120.65 | 247.65,120.65 224.79,120.65 IC17.1 | 265.43,154.94 247.65,154.94 | IC18.10 288.29,120.65 265.43,120.65 | 265.43,120.65 IC18.1 | 265.43,120.65 247.65,120.65 | IC19.10 247.65,86.36 | 247.65,86.36 224.79,86.36 IC19.1 | IC20.10 288.29,86.36 265.43,86.36 | 265.43,86.36 IC20.1 | 265.43,86.36 247.65,86.36 | IC22.10 288.29,52.07 265.43,52.07 | 265.43,52.07 IC22.1 | IC21.10 247.65,52.07 | 247.65,52.07 224.79,52.07 IC21.1 | 265.43,52.07 247.65,52.07 | 265.43,19.05 288.29,19.05 IC24.10 v288.29,13.97 | 265.43,19.05 IC24.1 | 265.43,19.05 247.65,19.05 | 247.65,19.05 IC23.10 | IC23.1 224.79,19.05 247.65,19.05 | 499.11,199.39 499.11,207.01 UKLOP_COMMON.8 505.46,208.28 510.54,208.28 511.81,207.01 JP2.2
  Bottom 0.61: UKLOP_COMMON.5 499.11,199.39 | 499.11,199.39 499.11,196.85 | 499.11,196.85 UKLOP_COMMON.4 511.81,196.85 516.89,191.77 JP1.4 | OMOGOCANJE_BLUE.4 547.37,179.07 | 547.37,179.07 544.83,179.07 | 544.83,179.07 OMOGOCANJE_BLUE.5 | 544.83,179.07 537.21,179.07 | 537.21,179.07 OMOGOCANJE_BLUE.8 | 537.21,179.07 527.05,179.07 | OMOGOCANJE_GREEN.4 527.05,179.07 | 527.05,179.07 524.51,179.07 | OMOGOCANJE_GREEN.5 524.51,179.07 | 524.51,179.07 516.89,179.07 | OMOGOCANJE_GREEN.8 516.89,179.07 | 516.89,179.07 506.73,179.07 | OMOGOCANJE_RED.4 506.73,179.07 | 506.73,179.07 504.19,179.07 OMOGOCANJE_RED.5 504.19,186.69 499.11,186.69 | 499.11,186.69 499.11,196.85 | 547.37,179.07 560.07,179.07 557.53,181.61 557.53,184.15 552.45,189.23 | PUKLOP.8 552.45,189.23 | 552.45,189.23 552.45,196.85 | PUKLOP.5 552.45,196.85 | 552.45,196.85 552.45,199.39 PUKLOP.4 | OMOGOCANJE_RED.8 496.57,186.69 499.11,186.69 | IC9.10 40.64,52.07 | 40.64,52.07 52.07,52.07
  Bottom 0.813: 52.07,52.07 58.42,52.07
  Bottom 1.676: Q153.E 8.64,1.52 8.89,1.27 20.32,1.27 | 20.32,1.27 33.02,1.27 | 33.02,1.27 45.72,1.27 | 45.72,1.27 58.42,1.27 | 58.42,1.27 71.12,1.27 | 71.12,1.27 83.82,1.27 | 83.82,1.27 96.52,1.27 96.52,4.83 | 96.52,4.83 Q149.E | Q154.E 20.07,1.52 20.32,1.27 | Q155.E 32.77,1.52 33.02,1.27 | Q156.E 45.47,1.52 45.72,1.27 | Q152.E 58.17,1.52 58.42,1.27 | Q151.E 70.87,1.52 71.12,1.27 | Q150.E 83.57,1.52 83.82,1.27 | 96.52,4.83 96.52,7.62 87.63,16.51 IC12.10 v81.28,13.97
COMMON0
  Bottom 0.61: UKLOP_COMMON.3 508,194.31 JP1.2
COMMON1
  Bottom 0.61: UKLOP_COMMON.2 508,191.77 JP1.1
COMMON2
  Bottom 0.61: UKLOP_COMMON.1 505.46,189.23 506.73,187.96 516.89,187.96 JP1.5
N$1
  Bottom 0.813: Q149.B 91.69,6.1 R198.2
N$2
  Bottom 0.813: R12.1 Q5.3
N$3
  Bottom 0.61: R196.2 77.47,6.6 Q150.B
N$4
  Bottom 0.61: R195.2 64.77,6.6 Q151.B
N$5
  Bottom 0.61: R191.2 52.07,6.6 Q152.B
N$6
  Bottom 0.61: R192.2 39.37,6.6 Q156.B
N$7
  Bottom 0.61: R193.2 26.67,6.6 Q155.B
N$8
  Bottom 0.61: R197.2 13.97,6.6 Q154.B
N$9
  Bottom 0.61: R194.2 1.52,7.62 Q153.B
N$10
  Bottom 0.813: UKLOP_SKUPNO.8 40.64,11.43 10.16,11.43 6.35,7.62 Q153.C
N$11
  Bottom 0.813: UKLOP_SKUPNO.7 43.18,10.16 21.59,10.16 17.78,6.35 Q154.C
N$12
  Bottom 0.813: UKLOP_SKUPNO.6 45.72,10.16 44.45,8.89 31.75,8.89 30.48,7.62 Q155.C
N$13
  Bottom 0.813: UKLOP_SKUPNO.5 48.26,10.16 45.47,7.37 44.2,7.37 43.18,6.35 Q156.C
N$14
  Bottom 0.813: UKLOP_SKUPNO.4 50.8,10.16 52.07,10.16 55.88,6.35 Q152.C
N$15
  Bottom 0.813: UKLOP_SKUPNO.3 53.34,11.43 55.88,8.89 66.04,8.89 68.58,6.35 Q151.C
N$16
  Bottom 0.813: UKLOP_SKUPNO.2 55.88,11.43 57.15,10.16 78.74,10.16 81.28,7.62 Q150.C
N$17
  Bottom 0.813: UKLOP_SKUPNO.1 59.69,11.43 88.9,11.43 93.98,6.35 Q149.C
N$18
  Bottom 0.61: R2.2 10.16,214 Q5.2
N$19
  Bottom 0.61: R1.2 15.24,214 Q1.2
N$20
  Bottom 0.813: R3.1 Q1.3
N$21
  Bottom 0.61: R4.2 20.32,214 Q2.2
N$22
  Bottom 0.813: R5.1 Q2.3
N$23
  Bottom 0.61: R8.2 25.4,214 Q3.2
N$24
  Bottom 0.813: R9.1 Q3.3
N$25
  Bottom 0.61: R10.2 30.48,214 Q4.2
N$26
  Bottom 0.813: R11.1 Q4.3
N$27
  Bottom 0.61: R201.2 35.56,214 Q6.2
N$28
  Bottom 0.813: R202.1 Q6.3
N$29
  Bottom 0.61: R203.2 40.64,214 Q7.2
N$30
  Bottom 0.813: R204.1 Q7.3
N$31
  Bottom 0.61: R205.2 45.72,214 Q157.2
N$32
  Bottom 0.813: R206.1 Q157.3
N$33
  Bottom 0.813: R7.1 Q158.3
N$34
  Bottom 0.813: R14.1 Q159.3
N$35
  Bottom 0.813: R16.1 Q160.3
N$36
  Bottom 0.813: R18.1 Q161.3
N$37
  Bottom 0.813: R20.1 Q162.3
N$38
  Bottom 0.813: R208.1 Q163.3
N$39
  Bottom 0.813: R210.1 Q164.3
N$40
  Bottom 0.813: R212.1 Q165.3
N$41
  Bottom 0.61: R6.2 50.8,214 Q158.2
N$42
  Bottom 0.813: R212.2 82.55,207.01 STOLP1.8
N$43
  Bottom 0.61: R13.2 55.88,214 Q159.2
N$44
  Bottom 0.813: STOLP1.7 76.2,205.74 77.47,204.47 81.28,204.47 83.82,201.93 R210.2
N$45
  Bottom 0.61: R15.2 60.96,214 Q160.2
N$46
  Bottom 0.813: STOLP1.6 73.66,205.74 77.47,201.93 78.74,201.93 R208.2
N$47
  Bottom 0.61: R17.2 66.04,214 Q161.2
N$48
  Bottom 0.813: STOLP1.5 71.12,204.47 73.66,201.93 R20.2
N$49
  Bottom 0.61: R19.2 71.12,214 Q162.2
N$50
  Bottom 0.813: R18.2 STOLP1.4
N$51
  Bottom 0.61: R207.2 76.2,214 Q163.2
N$52
  Bottom 0.813: R16.2 66.04,203.2 STOLP1.3
N$53
  Bottom 0.61: R209.2 81.28,214 Q164.2
N$54
  Bottom 0.813: R14.2 63.5,205.74 STOLP1.2
N$55
  Bottom 0.61: R211.2 86.36,214 Q165.2
N$56
  Bottom 0.813: R7.2 59.69,207.01 STOLP1.1
N$57
  Bottom 0.813: R206.2 41.91,207.01 STOLP.8
N$58
  Bottom 0.813: R204.2 43.18,201.93 41.91,203.2 38.1,203.2 35.56,205.74 STOLP.7
N$59
  Bottom 0.813: R202.2 35.56,203.2 34.29,203.2 34.29,204.47 33.02,205.74 STOLP.6
N$60
  Bottom 0.813: R11.2 33.02,201.93 30.48,204.47 STOLP.5
N$61
  Bottom 0.813: R9.2 STOLP.4
N$62
  Bottom 0.813: R5.2 25.4,205.74 STOLP.3
N$63
  Bottom 0.813: R3.2 17.78,201.93 19.05,203.2 20.32,203.2 22.86,205.74 STOLP.2
N$64
  Bottom 0.813: R12.2 12.7,203.2 16.51,207.01 STOLP.1
N$65
  Bottom 0.61: R213.2 10.16,179.7 Q166.2
N$66
  Bottom 0.813: R228.2 41.91,172.72 STOLP2.8
N$67
  Bottom 0.61: R215.2 15.24,179.7 Q167.2
N$68
  Bottom 0.813: R226.2 43.18,167.64 41.91,168.91 38.1,168.91 35.56,171.45 STOLP2.7
N$69
  Bottom 0.61: R217.2 20.32,179.7 Q168.2
N$70
  Bottom 0.813: R224.2 33.02,171.45 STOLP2.6
N$71
  Bottom 0.61: R219.2 25.4,179.7 Q169.2
N$72
  Bottom 0.813: R222.2 33.02,168.91 30.48,171.45 STOLP2.5
N$73
  Bottom 0.61: R221.2 30.48,179.7 Q170.2
N$74
  Bottom 0.813: R220.2 STOLP2.4
N$75
  Bottom 0.61: R223.2 35.56,179.7 Q171.2
N$76
  Bottom 0.813: R218.2 25.4,168.91 STOLP2.3
N$77
  Bottom 0.61: R225.2 40.64,179.7 Q172.2
N$78
  Bottom 0.813: R216.2 22.86,171.45 STOLP2.2
N$79
  Bottom 0.61: R227.2 45.72,179.7 Q173.2
N$80
  Bottom 0.813: R214.2 19.05,172.72 STOLP2.1
N$81
  Bottom 0.813: R214.1 Q166.3
N$82
  Bottom 0.813: R216.1 Q167.3
N$83
  Bottom 0.813: R218.1 Q168.3
N$84
  Bottom 0.813: R220.1 Q169.3
N$85
  Bottom 0.813: R222.1 Q170.3
N$86
  Bottom 0.813: R224.1 Q171.3
N$87
  Bottom 0.813: R226.1 Q172.3
N$88
  Bottom 0.813: R228.1 Q173.3
N$89
  Bottom 0.61: R229.2 50.8,179.7 Q174.2
N$90
  Bottom 0.813: R230.1 Q174.3
N$91
  Bottom 0.61: R231.2 55.88,179.7 Q175.2
N$92
  Bottom 0.813: R244.2 82.55,172.72 STOLP3.8
N$93
  Bottom 0.61: R233.2 60.96,179.7 Q176.2
N$94
  Bottom 0.813: R242.2 81.28,168.91 78.74,168.91 76.2,171.45 STOLP3.7
N$95
  Bottom 0.61: R235.2 66.04,179.7 Q177.2
N$96
  Bottom 0.813: R240.2 73.66,171.45 STOLP3.6
N$97
  Bottom 0.61: R237.2 71.12,179.7 Q178.2
N$98
  Bottom 0.813: R238.2 71.12,168.91 STOLP3.5
N$99
  Bottom 0.61: R239.2 76.2,179.7 Q179.2
N$100
  Bottom 0.813: R236.2 STOLP3.4
N$101
  Bottom 0.61: R241.2 81.28,179.7 Q180.2
N$102
  Bottom 0.813: R234.2 66.04,168.91 STOLP3.3
N$103
  Bottom 0.61: R243.2 86.36,179.7 Q181.2
N$104
  Bottom 0.813: R232.2 63.5,171.45 STOLP3.2
N$105
  Bottom 0.813: R230.2 59.69,172.72 STOLP3.1
N$106
  Bottom 0.813: R232.1 Q175.3
N$107
  Bottom 0.813: R234.1 Q176.3
N$108
  Bottom 0.813: R236.1 Q177.3
N$109
  Bottom 0.813: R238.1 Q178.3
N$110
  Bottom 0.813: R240.1 Q179.3
N$111
  Bottom 0.813: R242.1 Q180.3
N$112
  Bottom 0.813: R244.1 Q181.3
N$113
  Bottom 0.61: R245.2 10.16,145.41 Q182.2
N$114
  Bottom 0.813: R246.1 Q182.3
N$115
  Bottom 0.61: R247.2 15.24,145.41 Q183.2
N$116
  Bottom 0.813: R260.2 41.91,138.43 STOLP4.8
N$117
  Bottom 0.61: R249.2 20.32,145.41 Q184.2
N$118
  Bottom 0.813: R258.2 39.37,135.89 36.83,135.89 35.56,137.16 STOLP4.7
N$119
  Bottom 0.61: R251.2 25.4,145.41 Q185.2
N$120
  Bottom 0.813: R256.2 33.02,137.16 STOLP4.6
N$121
  Bottom 0.61: R253.2 30.48,145.41 Q186.2
N$122
  Bottom 0.813: R254.2 30.48,134.62 STOLP4.5
N$123
  Bottom 0.61: R255.2 35.56,145.41 Q187.2
N$124
  Bottom 0.813: R252.2 STOLP4.4
N$125
  Bottom 0.61: R257.2 40.64,145.41 Q188.2
N$126
  Bottom 0.813: R250.2 25.4,134.62 STOLP4.3
N$127
  Bottom 0.61: R259.2 45.72,145.41 Q189.2
N$128
  Bottom 0.813: R248.2 22.86,137.16 STOLP4.2
N$129
  Bottom 0.813: R248.1 Q183.3
N$130
  Bottom 0.813: R250.1 Q184.3
N$131
  Bottom 0.813: R246.2 19.05,138.43 STOLP4.1
N$132
  Bottom 0.813: R252.1 Q185.3
N$133
  Bottom 0.813: R254.1 Q186.3
N$134
  Bottom 0.813: R256.1 Q187.3
N$135
  Bottom 0.813: R258.1 Q188.3
N$136
  Bottom 0.813: R260.1 Q189.3
N$137
  Bottom 0.61: R261.2 50.8,145.41 Q190.2
N$138
  Bottom 0.813: R276.2 82.55,138.43 STOLP5.8
N$139
  Bottom 0.61: R263.2 55.88,145.41 Q191.2
N$140
  Bottom 0.813: R274.2 81.28,134.62 78.74,134.62 76.2,137.16 STOLP5.7
N$141
  Bottom 0.61: R265.2 60.96,145.41 Q192.2
N$142
  Bottom 0.813: R272.2 73.66,137.16 STOLP5.6
N$143
  Bottom 0.61: R267.2 66.04,145.41 Q193.2
N$144
  Bottom 0.813: R270.2 71.12,134.62 STOLP5.5
N$145
  Bottom 0.61: R269.2 71.12,145.41 Q194.2
N$146
  Bottom 0.813: R268.2 STOLP5.4
N$147
  Bottom 0.61: R271.2 76.2,145.41 Q195.2
N$148
  Bottom 0.813: R266.2 66.04,134.62 STOLP5.3
N$149
  Bottom 0.61: R273.2 81.28,145.41 Q196.2
N$150
  Bottom 0.813: R264.2 63.5,137.16 STOLP5.2
N$151
  Bottom 0.61: R275.2 86.36,145.41 Q197.2
N$152
  Bottom 0.813: R262.2 59.69,138.43 STOLP5.1
N$153
  Bottom 0.813: R262.1 Q190.3
N$154
  Bottom 0.813: R264.1 Q191.3
N$155
  Bottom 0.813: R266.1 Q192.3
N$156
  Bottom 0.813: R268.1 Q193.3
N$157
  Bottom 0.813: R270.1 Q194.3
N$158
  Bottom 0.813: R272.1 Q195.3
N$159
  Bottom 0.813: R274.1 Q196.3
N$160
  Bottom 0.813: R276.1 Q197.3
N$161
  Bottom 0.61: R277.2 10.16,111.12 Q198.2
N$162
  Bottom 0.813: R292.2 41.91,104.14 STOLP6.8
N$163
  Bottom 0.61: R279.2 15.24,111.12 Q199.2
N$164
  Bottom 0.813: R290.2 39.37,101.6 36.83,101.6 35.56,102.87 STOLP6.7
N$165
  Bottom 0.61: R281.2 20.32,111.12 Q200.2
N$166
  Bottom 0.813: R288.2 33.02,102.87 STOLP6.6
N$167
  Bottom 0.61: R283.2 25.4,111.12 Q201.2
N$168
  Bottom 0.813: R286.2 30.48,100.33 STOLP6.5
N$169
  Bottom 0.61: R285.2 30.48,111.12 Q202.2
N$170
  Bottom 0.813: R284.2 STOLP6.4
N$171
  Bottom 0.61: R287.2 35.56,111.12 Q203.2
N$172
  Bottom 0.813: R282.2 25.4,100.33 STOLP6.3
N$173
  Bottom 0.61: R289.2 40.64,111.12 Q204.2
N$174
  Bottom 0.813: R280.2 22.86,102.87 STOLP6.2
N$175
  Bottom 0.61: R291.2 45.72,111.12 Q205.2
N$176
  Bottom 0.813: R278.2 19.05,104.14 STOLP6.1
N$177
  Bottom 0.813: R278.1 Q198.3
N$178
  Bottom 0.813: R280.1 Q199.3
N$179
  Bottom 0.813: R282.1 Q200.3
N$180
  Bottom 0.813: R284.1 Q201.3
N$181
  Bottom 0.813: R286.1 Q202.3
N$182
  Bottom 0.813: R288.1 Q203.3
N$183
  Bottom 0.813: R290.1 Q204.3
N$184
  Bottom 0.813: R292.1 Q205.3
N$185
  Bottom 0.61: R293.2 50.8,111.12 Q206.2
N$186
  Bottom 0.813: R294.1 Q206.3
N$187
  Bottom 0.61: R295.2 55.88,111.12 Q207.2
N$188
  Bottom 0.813: R308.2 82.55,104.14 STOLP7.8
N$189
  Bottom 0.61: R297.2 60.96,111.12 Q208.2
N$190
  Bottom 0.813: R306.2 80.01,101.6 77.47,101.6 76.2,102.87 STOLP7.7
N$191
  Bottom 0.61: R299.2 66.04,111.12 Q209.2
N$192
  Bottom 0.813: R304.2 73.66,102.87 STOLP7.6
N$193
  Bottom 0.61: R301.2 71.12,111.12 Q210.2
N$194
  Bottom 0.813: R302.2 71.12,100.33 STOLP7.5
N$195
  Bottom 0.61: R303.2 76.2,111.12 Q211.2
N$196
  Bottom 0.813: R300.2 STOLP7.4
N$197
  Bottom 0.61: R305.2 81.28,111.12 Q212.2
N$198
  Bottom 0.813: R298.2 66.04,100.33 STOLP7.3
N$199
  Bottom 0.61: R307.2 86.36,111.12 Q213.2
N$200
  Bottom 0.813: R296.2 63.5,102.87 STOLP7.2
N$201
  Bottom 0.813: R294.2 59.69,104.14 STOLP7.1
N$202
  Bottom 0.813: R296.1 Q207.3
N$203
  Bottom 0.813: R298.1 Q208.3
N$204
  Bottom 0.813: R300.1 Q209.3
N$205
  Bottom 0.813: R302.1 Q210.3
N$206
  Bottom 0.813: R304.1 Q211.3
N$207
  Bottom 0.813: R306.1 Q212.3
N$208
  Bottom 0.813: R308.1 Q213.3
N$209
  Bottom 0.61: R309.2 10.16,76.84 Q214.2
N$210
  Bottom 0.813: R324.2 41.91,69.85 STOLP8.8
N$211
  Bottom 0.61: R311.2 15.24,76.84 Q215.2
N$212
  Bottom 0.813: R322.2 39.37,67.31 36.83,67.31 35.56,68.58 STOLP8.7
N$213
  Bottom 0.61: R313.2 20.32,76.84 Q216.2
N$214
  Bottom 0.813: R320.2 33.02,68.58 STOLP8.6
N$215
  Bottom 0.61: R315.2 25.4,76.84 Q217.2
N$216
  Bottom 0.813: R318.2 30.48,66.04 STOLP8.5
N$217
  Bottom 0.61: R317.2 30.48,76.84 Q218.2
N$218
  Bottom 0.813: R316.2 STOLP8.4
N$219
  Bottom 0.61: R319.2 35.56,76.84 Q219.2
N$220
  Bottom 0.813: R314.2 25.4,66.04 STOLP8.3
N$221
  Bottom 0.61: R321.2 40.64,76.84 Q220.2
N$222
  Bottom 0.813: R312.2 22.86,68.58 STOLP8.2
N$223
  Bottom 0.61: R323.2 45.72,76.84 Q221.2
N$224
  Bottom 0.813: R310.2 19.05,69.85 STOLP8.1
N$225
  Bottom 0.813: Q214.3 R310.1
N$226
  Bottom 0.813: Q215.3 R312.1
N$227
  Bottom 0.813: Q216.3 R314.1
N$228
  Bottom 0.813: Q217.3 R316.1
N$229
  Bottom 0.813: Q218.3 R318.1
N$230
  Bottom 0.813: Q219.3 R320.1
N$231
  Bottom 0.813: Q220.3 R322.1
N$232
  Bottom 0.813: Q221.3 R324.1
N$233
  Bottom 0.61: R325.2 217.17,145.41 Q222.2
N$234
  Bottom 0.813: Q286.3 R454.1
N$235
  Bottom 0.61: R327.2 222.25,145.41 Q223.2
N$236
  Bottom 0.813: R468.2 82.55,69.85 STOLP9.8
N$237
  Bottom 0.61: R329.2 227.33,145.41 Q224.2
N$238
  Bottom 0.813: R466.2 80.01,67.31 77.47,67.31 76.2,68.58 STOLP9.7
N$239
  Bottom 0.61: R331.2 232.41,145.41 Q225.2
N$240
  Bottom 0.813: R464.2 73.66,68.58 STOLP9.6
N$241
  Bottom 0.61: R333.2 237.49,145.41 Q226.2
N$242
  Bottom 0.813: R462.2 71.12,66.04 STOLP9.5
N$243
  Bottom 0.61: R335.2 242.57,145.41 Q227.2
N$244
  Bottom 0.813: R460.2 STOLP9.4
N$245
  Bottom 0.61: R337.2 247.65,145.41 Q228.2
N$246
  Bottom 0.813: R458.2 66.04,66.04 STOLP9.3
N$247
  Bottom 0.61: R339.2 252.73,145.41 Q229.2
N$248
  Bottom 0.813: R456.2 63.5,68.58 STOLP9.2
N$249
  Bottom 0.813: R454.2 59.69,69.85 STOLP9.1
N$250
  Bottom 0.813: R456.1 Q287.3
N$251
  Bottom 0.813: Q288.3 R458.1
N$252
  Bottom 0.813: Q289.3 R460.1
N$253
  Bottom 0.813: Q290.3 R462.1
N$254
  Bottom 0.813: Q291.3 R464.1
N$255
  Bottom 0.813: Q292.3 R466.1
N$256
  Bottom 0.813: Q293.3 R468.1
N$257
  Bottom 0.61: R341.2 257.81,145.41 Q230.2
N$258
  Bottom 0.813: R470.1 Q294.3
N$259
  Bottom 0.61: R343.2 262.89,145.41 Q231.2
N$260
  Bottom 0.813: R484.2 41.91,35.56 STOLP10.8
N$261
  Bottom 0.61: R345.2 267.97,145.41 Q232.2
N$262
  Bottom 0.813: R482.2 39.37,33.02 36.83,33.02 35.56,34.29 STOLP10.7
N$263
  Bottom 0.61: R347.2 273.05,145.41 Q233.2
N$264
  Bottom 0.813: R480.2 33.02,34.29 STOLP10.6
N$265
  Bottom 0.61: R349.2 278.13,145.41 Q234.2
N$266
  Bottom 0.813: R478.2 30.48,31.75 STOLP10.5
N$267
  Bottom 0.61: R351.2 283.21,145.41 Q235.2
N$268
  Bottom 0.813: R476.2 STOLP10.4
N$269
  Bottom 0.61: R353.2 288.29,145.41 Q236.2
N$270
  Bottom 0.813: R474.2 25.4,31.75 STOLP10.3
N$271
  Bottom 0.61: R355.2 293.37,145.41 Q237.2
N$272
  Bottom 0.813: R472.2 22.86,34.29 STOLP10.2
N$273
  Bottom 0.813: R470.2 19.05,35.56 STOLP10.1
N$274
  Bottom 0.813: R472.1 Q295.3
N$275
  Bottom 0.813: R474.1 Q296.3
N$276
  Bottom 0.813: R476.1 Q297.3
N$277
  Bottom 0.813: R478.1 Q298.3
N$278
  Bottom 0.813: R480.1 Q299.3
N$279
  Bottom 0.813: R482.1 Q300.3
N$280
  Bottom 0.813: R484.1 Q301.3
N$281
  Bottom 0.61: R357.2 217.17,111.12 Q238.2
N$282
  Bottom 0.813: R500.2 82.55,35.56 STOLP11.8
N$283
  Bottom 0.61: R359.2 222.25,111.12 Q239.2
N$284
  Bottom 0.813: R498.2 80.01,33.02 77.47,33.02 76.2,34.29 STOLP11.7
N$285
  Bottom 0.61: R361.2 227.33,111.12 Q240.2
N$286
  Bottom 0.813: R496.2 73.66,34.29 STOLP11.6
N$287
  Bottom 0.61: R363.2 232.41,111.12 Q241.2
N$288
  Bottom 0.813: R494.2 71.12,31.75 STOLP11.5
N$289
  Bottom 0.61: R365.2 237.49,111.12 Q242.2
N$290
  Bottom 0.813: R492.2 STOLP11.4
N$291
  Bottom 0.61: R367.2 242.57,111.12 Q243.2
N$292
  Bottom 0.813: R490.2 66.04,31.75 STOLP11.3
N$293
  Bottom 0.61: R369.2 247.65,111.12 Q244.2
N$294
  Bottom 0.813: R488.2 63.5,34.29 STOLP11.2
N$295
  Bottom 0.61: R371.2 252.73,111.12 Q245.2
N$296
  Bottom 0.813: R486.2 59.69,35.56 STOLP11.1
N$297
  Bottom 0.813: Q302.3 R486.1
N$298
  Bottom 0.813: R488.1 Q303.3
N$299
  Bottom 0.813: R490.1 Q304.3
N$300
  Bottom 0.813: R492.1 Q305.3
N$301
  Top 0.61: 278.13,-1.27 -10.16,-1.27
N$302
  Bottom 0.813: R494.1 Q306.3
N$303
  Bottom 0.813: R496.1 Q307.3
N$304
  Bottom 0.813: R498.1 Q308.3
N$305
  Bottom 0.61: R373.2 257.81,111.12 Q246.2
N$306
  Bottom 0.813: R500.1 Q309.3
N$307
  Bottom 0.61: R375.2 262.89,111.12 Q247.2
N$308
  Bottom 0.813: R502.1 Q310.3
N$309
  Bottom 0.61: R377.2 267.97,111.12 Q248.2
N$310
  Bottom 0.813: R516.2 248.92,207.01 STOLP12.8
N$311
  Bottom 0.61: R379.2 273.05,111.12 Q249.2
N$312
  Bottom 0.813: R514.2 246.38,204.47 243.84,204.47 242.57,205.74 STOLP12.7
N$313
  Bottom 0.61: R381.2 278.13,111.12 Q250.2
N$314
  Bottom 0.813: R512.2 240.03,205.74 STOLP12.6
N$315
  Bottom 0.61: R383.2 283.21,111.12 Q251.2
N$316
  Bottom 0.813: R510.2 237.49,203.2 STOLP12.5
N$317
  Bottom 0.61: R385.2 288.29,111.12 Q252.2
N$318
  Bottom 0.813: R508.2 STOLP12.4
N$319
  Bottom 0.61: R387.2 293.37,111.12 Q253.2
N$320
  Bottom 0.813: R506.2 232.41,203.2 STOLP12.3
N$321
  Bottom 0.813: R504.2 229.87,205.74 STOLP12.2
N$322
  Bottom 0.813: R502.2 226.06,207.01 STOLP12.1
N$323
  Bottom 0.813: R504.1 Q311.3
N$324
  Bottom 0.813: R506.1 Q312.3
N$325
  Bottom 0.813: R508.1 Q313.3
N$326
  Bottom 0.813: R510.1 Q314.3
N$327
  Bottom 0.813: R512.1 Q315.3
N$328
  Bottom 0.813: R514.1 Q316.3
N$329
  Bottom 0.61: R389.2 217.17,76.84 Q254.2
N$330
  Bottom 0.813: R516.1 Q317.3
N$331
  Bottom 0.61: R391.2 222.25,76.84 Q255.2
N$332
  Bottom 0.813: R518.1 Q318.3
N$333
  Bottom 0.61: R393.2 227.33,76.84 Q256.2
N$334
  Bottom 0.813: R520.1 Q319.3
N$335
  Bottom 0.61: R395.2 232.41,76.84 Q257.2
N$336
  Bottom 0.813: R522.1 Q320.3
N$337
  Bottom 0.61: R397.2 237.49,76.84 Q258.2
N$338
  Bottom 0.813: R524.1 Q321.3
N$339
  Bottom 0.61: R399.2 242.57,76.84 Q259.2
N$340
  Bottom 0.813: R526.1 Q322.3
N$341
  Bottom 0.61: R401.2 247.65,76.84 Q260.2
N$342
  Bottom 0.813: R528.1 Q323.3
N$343
  Bottom 0.61: R403.2 252.73,76.84 Q261.2
N$344
  Bottom 0.813: R530.1 Q324.3
N$345
  Bottom 0.813: R532.1 Q325.3
N$346
  Bottom 0.813: R534.1 Q326.3
N$347
  Bottom 0.813: R532.2 289.56,207.01 STOLP13.8
N$348
  Bottom 0.813: R530.2 287.02,204.47 284.48,204.47 283.21,205.74 STOLP13.7
N$349
  Bottom 0.813: R528.2 280.67,205.74 STOLP13.6
N$350
  Bottom 0.813: R526.2 278.13,203.2 STOLP13.5
N$351
  Bottom 0.813: R524.2 STOLP13.4
N$352
  Bottom 0.813: R522.2 273.05,203.2 STOLP13.3
N$353
  Bottom 0.61: R405.2 257.81,76.84 Q262.2
N$354
  Bottom 0.813: R520.2 270.51,205.74 STOLP13.2
N$355